# Altium schematic sheet Main.SchDoc: Main
size A; Revision: REV1; SheetNumber: 1; SheetTotal: 4
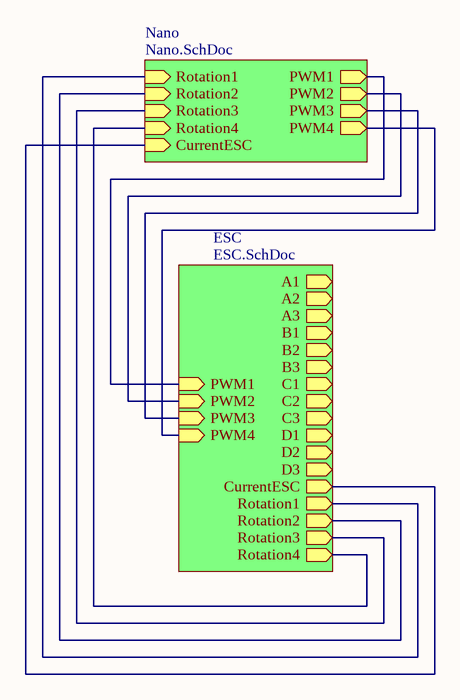
[diagram p0: Main.SchDoc]

## Sub-sheets
ESC = ESC.SchDoc: Rotation1 (out), Rotation4 (out), CurrentESC (out), D2 (out), D3 (out), Rotation3 (out), Rotation2 (out), C1 (out), D1 (out), A3 (out), B3 (out), A2 (out), B2 (out), C2 (out), C3 (out), B1 (out), A1 (out), PWM3 (in), PWM2 (in), PWM4 (in), PWM1 (in)
Nano = Nano.SchDoc: Rotation2 (in), PWM4 (out), PWM2 (out), CurrentESC (in), Rotation4 (in), Rotation1 (in), PWM1 (out), PWM3 (out), Rotation3 (in)

## Nets
(unnamed): sheet ESC/Rotation1, sheet Nano/Rotation1
(unnamed): sheet ESC/Rotation4, sheet Nano/Rotation4
(unnamed): sheet ESC/CurrentESC, sheet Nano/CurrentESC
(unnamed): sheet ESC/Rotation3, sheet Nano/Rotation3
(unnamed): sheet ESC/Rotation2, sheet Nano/Rotation2
(unnamed): sheet ESC/PWM3, sheet Nano/PWM3
(unnamed): sheet ESC/PWM2, sheet Nano/PWM2
(unnamed): sheet ESC/PWM4, sheet Nano/PWM4
(unnamed): sheet ESC/PWM1, sheet Nano/PWM1